# Altium schematic sheet PWR.SchDoc: Наименование
size 209 x 297 mm; ApprovedBy: Утвердил; CheckedBy: Проверил; Author: Разработал; CompanyName: Организация; DrawnBy: Н.Контр; Engineer: Т.Контр; SheetNumber: 1; SheetTotal: 1; PageSetup: Record=PageOptions|CenterHorizontal=True|CenterVertical=True|PrintScale=0.94|XCorrection=1.00|YCorrection=1.00|PrintKind=1|BorderSize=5000000|LeftOffset=0|BottomOffset=0|Orientation=1|PaperLength=1000|PaperWidth=1000|Scale=100|PaperSource=7|PrintQuality=-4|MediaType=1|DitherType=10|PaperKind=A4|PrintScaleMode=1; DecimalNumber: Децимальный номер; HeadOfSector: Нач. сектора; MainDevice: Перв.примен.; Name: Наименование; DocumentName: Sheet1.SCHDOC
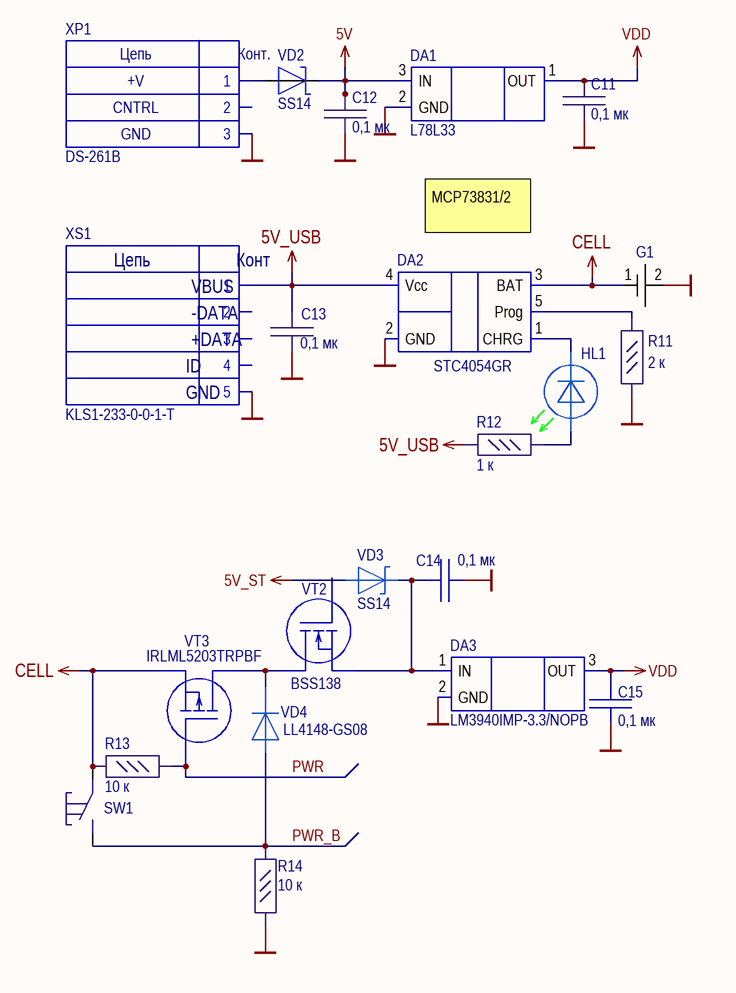
[diagram p0: PWR.SchDoc]

## Parts
C11  0,1 мк  [C_0603]
C12  0,1 мк  [C_0603]
C13  0,1 мк  [C_0603]
C14  0,1 мк  [C_0805]
C15  0,1 мк  [C_0805]
DA1  L78L33  [SOT89]
DA2  STC4054GR  [TSOT23-5L]
DA3  LM3940IMP-3.3/NOPB  [SOT223]
G1  12BHC186P1-GR  [12BHC186P1-GR]  (value not drawn)
HL1  BL-HGK36G  [LED_0603_GREEN]  (value not drawn)
R11  2 к  [R_0603]
R12  1 к  [R_0603]
R13  10 к  [R_0603]
R14  10 к  [R_0603]
SW1  KLS7-TS6604  [KLS7-TS6604-5.0-180-B]  (value not drawn)
VD2  SS14  [DO-214AC]
VD3  SS14  [DO-214AC]
VD4  LL4148-GS08  [SOD-80]
VT2  BSS138  [SOT23]
VT3  IRLML5203TRPBF  [SOT23]
XP1  DS-261B  [DS-261]
XS1  KLS1-233-0-0-1-T  [KLS1-233-0-0-1-T]

## Nets
5V: C12.1 DA1.3(IN) VD2.2
5V_ST: VD3.1
5V_USB: C13.2 DA2.4(Vcc) R12.2 XS1.1
CELL: DA2.3(BAT) G1.1 R13.1 SW1.2 VT3.2(S)
GND: C11.2 C12.2 C13.1 C14.2 C15.1 DA1.2(GND) DA2.2(GND) DA3.2(GND) G1.2 R11.1 R14.1 XP1.3 XS1.5
VDD: C11.1 C15.2 DA1.1(OUT) DA3.3(OUT)
PWR: R13.2 VT3.1(G)
PWR_B: R14.2 SW1.1 VD4.1
NetC14_1: C14.1 DA3.1(IN) VD3.2 VT2.2(S)
NetDA2_1: DA2.1(CHRG) HL1.2
NetDA2_5: DA2.5(Prog) R11.2
NetHL1_1: HL1.1 R12.1
NetVD2_1: VD2.1 XP1.1
NetVD4_2: VD4.2 VT2.3(D) VT3.3(D)

Not connected (* = marked no-connect by the designer): VT2 1(G); XP1 2; XS1 2 3 4

## Notes on the sheet
- MCP73831/2
- Перв.примен.
- Справ.№
- Подп. и дата
- Инв.№ дубл.
- Взам.инв.№
- Подп.и дата
- Разраб.
- Изм.
- Лист
- № докум.
- Подп.
- Дата
- Лит.
- Масштаб
- Масса
- Т.контр.
- Пров.
- ПРИНЦИПИАЛЬНАЯ
- СХЕМА   ЭЛЕКТРИЧЕСКАЯ
- Листов
- Инв.№ подл.
- Утв.
- Н.контр.
- Нач.сект.
- Копировал
- Формат  A3
- (in symbol DS-261B) Цепь; Конт.; +V; CNTRL; GND
- (in symbol KLS1-233-0-0-1-T) Цепь; Конт; VBUS; -DATA; +DATA; ID; GND

## Library data of the parts
C11-C13 = GRM188R72A104MA35D: CAP CER 0.1UF 100V X7R 0603; Manufacturer: Murata Electronics; Value: 0.1µF; Part Number: GRM188R72A104MA35D; ComponentLink1URL: https://search.murata.co.jp/Ceramy/image/img/A01X/G101/ENG/GRM188R72A104MA35-01.pdf; ComponentLink1Description: Datasheet; Component Type: Capasitor
C14 C15 = C_0805
DA1 = L78L33ABUTR
DA2 = STC4054GR: Контроллер заряда Lion батарей
DA3 = LM3940IMP-3.3/NOPB: Регулятор с малым падением напряжения, преобразование 5В в 3.3В/ 1А
G1 = 12BHC186P1-GR: Батарейный отсек 1x18650
R11 = CR0603-FX-2001ELF: RES SMD 2K OHM 1% 1/10W 0603; Manufacturer: Bourns Inc.; Part Number: CR0603-FX-2001ELF; Value: 2 к; ComponentLink1URL: https://www.bourns.com/pdfs/chpreztr.pdf; ComponentLink1Description: Datasheet; Component Type: Resistor
R12 = CR0603-FX-1001ELF: RES SMD 1K OHM 1% 1/10W 0603; Manufacturer: Bourns Inc.; Part Number: CR0603-FX-1001ELF; Value: 1 к; ComponentLink1URL: https://www.bourns.com/pdfs/chpreztr.pdf; ComponentLink1Description: Datasheet; Component Type: Resistor
R13 R14 = CR0603-FX-1002ELF: RES SMD 10K OHM 1% 1/10W 0603; Manufacturer: Bourns Inc.; Part Number: CR0603-FX-1002ELF; Value: 10 к; ComponentLink1URL: https://www.bourns.com/pdfs/chpreztr.pdf; ComponentLink1Description: Datasheet; Component Type: Resistor
VD4 = LL4148-GS08: Диод
VT2 = BSS138: MOSFET, N-канал, 0.2А, 50В
VT3 = IRLML5203TRPBF: Транзистор, P-канал 30В 3A logic